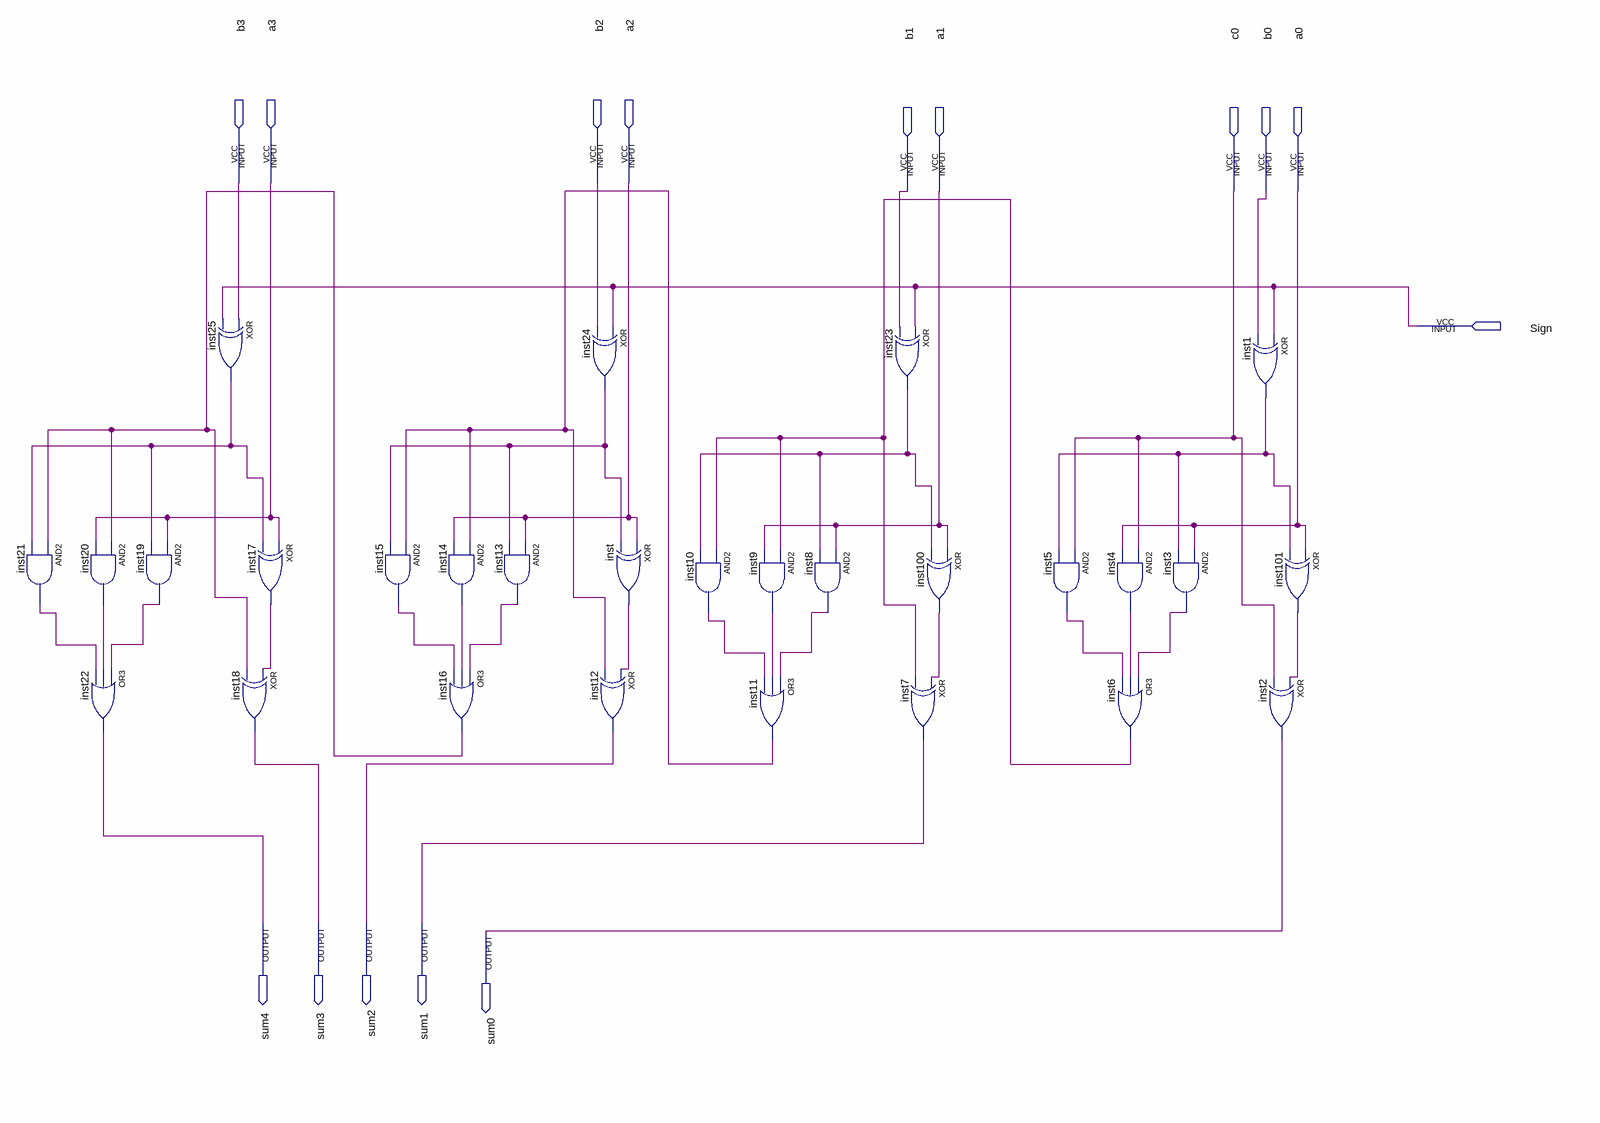
[diagram p0: schematic sheet]
// Quartus schematic adder_subtractor.bdf as structural Verilog: 28 symbols, 15 pins
module adder_subtractor (
  input  b3,
  input  a3,
  input  b2,
  input  a2,
  input  b1,
  input  a1,
  input  c0,
  input  b0,
  input  a0,
  input  Sign,
  output sum4,
  output sum3,
  output sum2,
  output sum1,
  output sum0
);

  wire inst1_out, inst3_out, inst4_out, inst5_out, inst6_out, inst8_out, inst9_out, inst10_out, inst11_out,
       inst13_out, inst14_out, inst15_out, inst16_out, inst17_out, inst19_out, inst20_out, inst21_out,
       inst23_out, inst24_out, inst25_out, inst100_out, inst101_out, inst_out;

  and inst21 (inst21_out, inst16_out, inst25_out);
  and inst19 (inst19_out, a3, inst25_out);
  and inst20 (inst20_out, inst16_out, a3);
  or inst22 (sum4, inst19_out, inst20_out, inst21_out);
  xor inst25 (inst25_out, b3, Sign);
  xor inst17 (inst17_out, a3, inst25_out);
  xor inst18 (sum3, inst17_out, inst16_out);
  and inst15 (inst15_out, inst11_out, inst24_out);
  and inst14 (inst14_out, inst11_out, a2);
  or inst16 (inst16_out, inst13_out, inst14_out, inst15_out);
  and inst13 (inst13_out, a2, inst24_out);
  xor inst24 (inst24_out, Sign, b2);
  xor inst (inst_out, a2, inst24_out);
  xor inst12 (sum2, inst_out, inst11_out);
  and inst10 (inst10_out, inst6_out, inst23_out);
  and inst9 (inst9_out, inst6_out, a1);
  or inst11 (inst11_out, inst8_out, inst9_out, inst10_out);
  and inst8 (inst8_out, a1, inst23_out);
  xor inst23 (inst23_out, Sign, b1);
  xor inst7 (sum1, inst100_out, inst6_out);
  xor inst100 (inst100_out, a1, inst23_out);
  and inst5 (inst5_out, c0, inst1_out);
  and inst4 (inst4_out, c0, a0);
  or inst6 (inst6_out, inst3_out, inst4_out, inst5_out);
  and inst3 (inst3_out, a0, inst1_out);
  xor inst1 (inst1_out, Sign, b0);
  xor inst101 (inst101_out, a0, inst1_out);
  xor inst2 (sum0, inst101_out, c0);
endmodule
